# Altium schematic sheet Rampa.SchDoc
size A
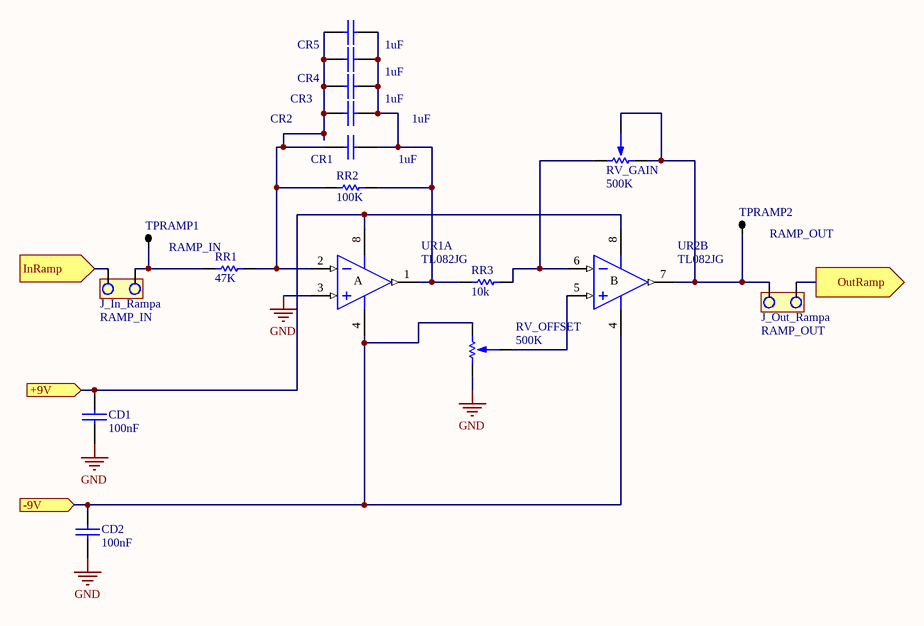
[diagram p0: Rampa.SchDoc]

## Parts
CD1  100nF  [0805]
CD2  100nF  [0805]
CR1  1uF  [0805]
CR2  1uF  [0805]
CR3  1uF  [0805]
CR4  1uF  [0805]
CR5  1uF  [0805]
J_In_Rampa  RAMP_IN  [JUMPER2]
J_Out_Rampa  RAMP_OUT  [JUMPER2]
RR1  47K  [0805]
RR2  100K  [0805]
RR3  10k  [0805]
RV_GAIN  500K  [PRESET V]
RV_OFFSET  500K  [PRESET V]
TPRAMP1  RAMP_IN  [TPTH]
TPRAMP2  RAMP_OUT  [TPTH]
UR1  TL082JG  [JG008]  (part A of 2)
UR2  TL082JG  [JG008]  (part B of 2)

## Ports
+9V (in), -9V (in), InRamp (in), OutRamp (out)

## Nets
GND: CD1.2 CD2.2 RV_OFFSET.3 UR1.3(IN+)
+9V: CD1.1 UR1.8(V+) UR2.8(V+) ; port +9V
-9V: CD2.1 RV_OFFSET.1 UR1.4(V-) UR2.4(V-) ; port -9V
InRamp: J_In_Rampa.1 ; port InRamp
OutRamp: J_Out_Rampa.2 ; port OutRamp
NetCR1_1: CR1.1 CR2.1 CR3.1 CR4.1 CR5.1 RR1.2 RR2.1 UR1.2(IN-)
NetCR1_2: CR1.2 CR2.2 CR3.2 CR4.2 CR5.2 RR2.2 RR3.1 UR1.1(OUT)
NetJ_In_Rampa_2: J_In_Rampa.2 RR1.1 TPRAMP1.1
NetJ_Out_Rampa_1: J_Out_Rampa.1 RV_GAIN.2 RV_GAIN.3 TPRAMP2.1 UR2.7(OUT)
NetRR3_2: RR3.2 RV_GAIN.1 UR2.6(IN-)
NetRV_OFFSET_2: RV_OFFSET.2 UR2.5(IN+)

## Notes on the sheet
- (in symbol TL082JG, part A) A
- (in symbol TL082JG, part B) B

## Library data of the parts
CD1 CD2 CR1-CR5 = CAP
J_In_Rampa J_Out_Rampa = JUMPER
RR1-RR3 = RES
RV_GAIN RV_OFFSET = PRESET
TPRAMP1 TPRAMP2 = TP
UR1 UR2 = TL082JG: JFET-Input Operational Amplifier; Published: 16-Jan-2001; LatestRevisionDate: 04-Mar-2005; LatestRevisionNote: Stylized 3D Model Added.; DatasheetVersion: Feb-1999; PackageVersion: Jan-1995; PackageReference: JG008; Publisher: Altium Limited; PackageDescription: DIP; 8 Leads; Row Spacing 7.62 mm; Pitch 2.54 mm; ComponentLink1Description: Manufacturer Link; ComponentLink1URL: http://www.ti.com/; ComponentLink2Description: Datasheet; ComponentLink2URL: http://www-s.ti.com/sc/ds/tl082.pdf